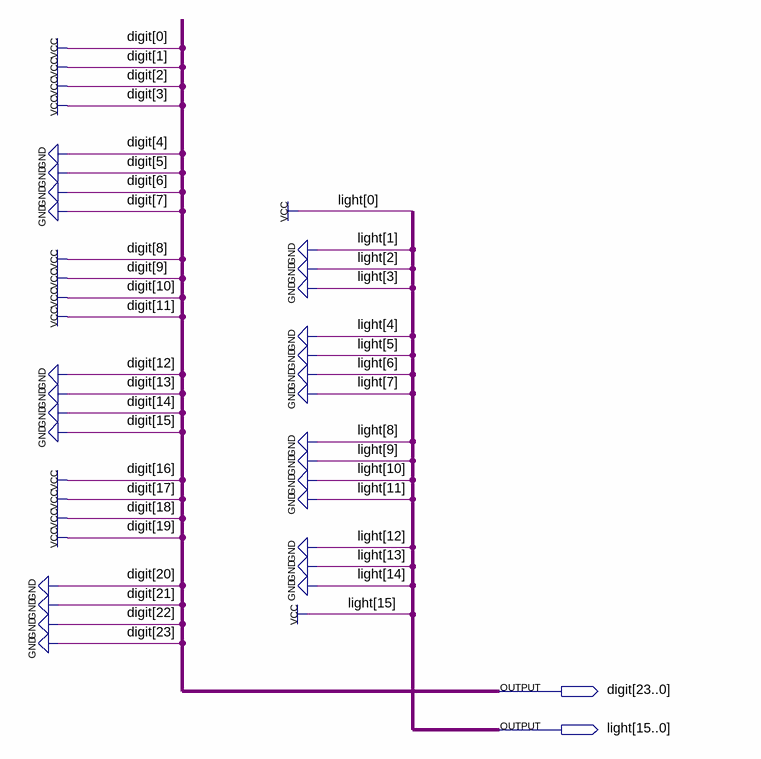
[diagram p0: schematic sheet]
// Quartus schematic Pattern_4_Frame_0.bdf as structural Verilog: 0 symbols, 2 pins
module Pattern_4_Frame_0 (
  output [23:0] digit,
  output [15:0] light
);


  assign digit = 24'b000011110000111100001111;
  assign light = 16'b1000000000000001;
endmodule
